# Altium schematic sheet bb_periferia.SchDoc
size A4; SheetNumber: 2; SheetTotal: 6
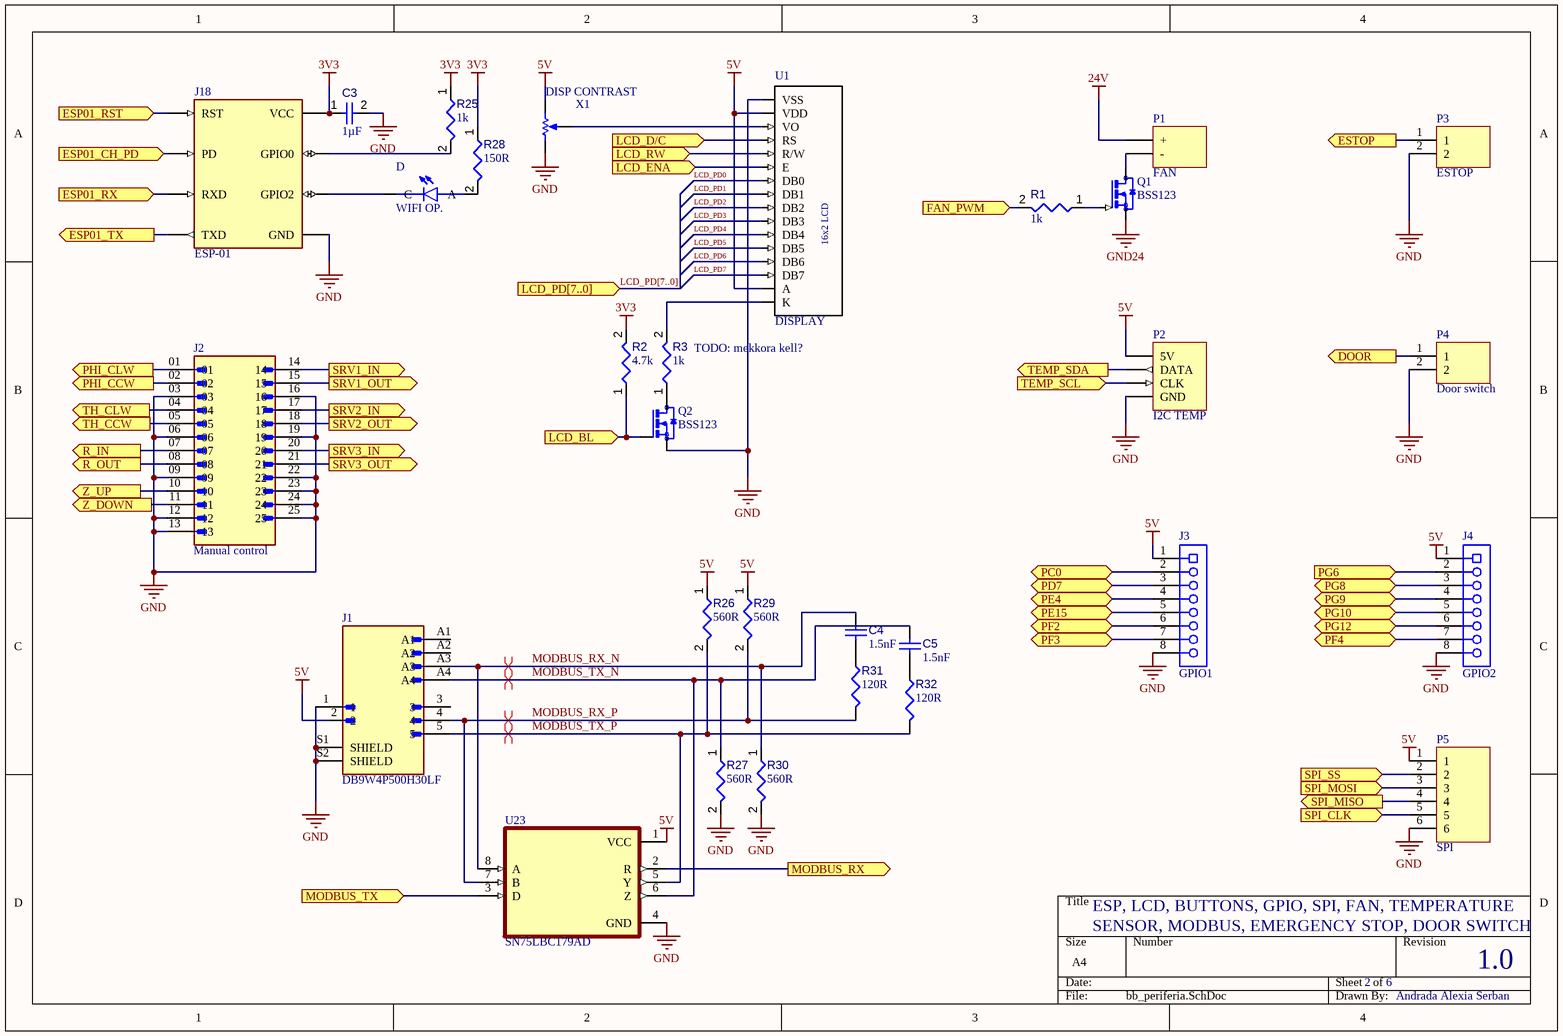
[diagram p0: bb_periferia.SchDoc]

## Parts
C3  value 1µF  [CAPC2013X145X50ML20T25]  (hidden comment: Capacitor 1 uF +/- 10% 25 V 0805)
C4  value 1.5nF  [CAPC2013X145X50ML20T25]  (hidden comment: Capacitor 1 uF +/- 10% 25 V 0805)
C5  value 1.5nF  [CAPC2013X145X50ML20T25]  (hidden comment: Capacitor 1 uF +/- 10% 25 V 0805)
D  WIFI OP.  [LEDC2012X70N]
J1  DB9W4P500H30LF  [AMPHENOL_DB9W4P500H30LF]
J2  Manual control  [AMPHENOL_DB25P564CTXLF]
J3  GPIO1  [SLIN-PPPC081LFBN-RC_V]
J4  GPIO2  [SLIN-PPPC081LFBN-RC_V]
J18  ESP-01  [ESP-01]
P1  FAN  [FP_CONN2_TAP_254MM]
P2  I2C TEMP  [FP_CONN4_TAP_254MM]
P3  ESTOP  [FP_CONN2_TAP_254MM]
P4  Door switch  [FP_CONN2_TAP_254MM]
P5  SPI  [FP_CONN6_TAP_254MM]
Q1  BSS123  [SOT23]
Q2  BSS123  [SOT23]
R1  value 1k  [RESC0402(1005)_L]  (hidden comment: Resistor 200R +/-5 % 0402 63 mW)
R2  value 4.7k  [RESC2013X70X40ML20T20]  (hidden comment: Resistor 4k7 +/-1% 0805 125 mW)
R3  value 1k  [RESC0805(2012)_L]  (hidden comment: 1KR5J)
R25  value 1k  [RESC0402(1005)_L]  (hidden comment: Resistor 200R +/-5 % 0402 63 mW)
R26  value 560R  [RESC0402(1005)_L]  (hidden comment: Resistor 200R +/-5 % 0402 63 mW)
R27  value 560R  [RESC0402(1005)_L]  (hidden comment: Resistor 200R +/-5 % 0402 63 mW)
R28  value 150R  [RESC0402(1005)_L]  (hidden comment: Resistor 200R +/-5 % 0402 63 mW)
R29  value 560R  [RESC0402(1005)_L]  (hidden comment: Resistor 200R +/-5 % 0402 63 mW)
R30  value 560R  [RESC0402(1005)_L]  (hidden comment: Resistor 200R +/-5 % 0402 63 mW)
R31  value 120R  [RESC0402(1005)_L]  (hidden comment: Resistor 200R +/-5 % 0402 63 mW)
R32  value 120R  [RESC0402(1005)_L]  (hidden comment: Resistor 200R +/-5 % 0402 63 mW)
U1  DISPLAY  [*LCD-16X2]
U23  SN75LBC179AD  [SOIC127P599X175-8N]
X1  DISP CONTRAST

## Ports
DOOR (out, see bb_Nucleo[4B]), ESP01_CH_PD (in, see bb_Nucleo[3B]), ESP01_RST (in, see bb_Nucleo[3B]), ESP01_RX (in, see bb_Nucleo[3B]), ESP01_TX (out, see bb_Nucleo[3B]), ESTOP (out, see bb_Nucleo[4B]), FAN_PWM (in, see bb_Nucleo[3C]), LCD_BL (in, see bb_Nucleo[3C]), LCD_D/C (in, see bb_Nucleo[4A]), LCD_ENA (in, see bb_Nucleo[4A]), LCD_PD[7..0] (in, see bb_Nucleo[4B]), LCD_RW (in, see bb_Nucleo[4A]), MODBUS_RX (out, see bb_Nucleo[3A]), MODBUS_TX (in, see bb_Nucleo[2B]), PC0 (bidir, see bb_Nucleo[2A]), PD7 (bidir, see bb_Nucleo[3A]), PE4 (bidir, see bb_Nucleo[3B]), PE15 (bidir, see bb_Nucleo[3C]), PF2 (bidir, see bb_Nucleo[4A]), PF3 (bidir, see bb_Nucleo[4A]), PF4 (bidir, see bb_Nucleo[4A]), PG6 (in, see bb_Nucleo[4B]), PG8 (bidir, see bb_Nucleo[4B]), PG9 (bidir, see bb_Nucleo[4B]), PG10 (bidir, see bb_Nucleo[4B]), PG12 (bidir, see bb_Nucleo[4C]), PHI_CCW (out, see bb_Nucleo[1B]), PHI_CLW (out, see bb_Nucleo[1B]), R_IN (out, see bb_Nucleo[1C]), R_OUT (out, see bb_Nucleo[1C]), SPI_CLK (in, see bb_Nucleo[2B]), SPI_MISO (out, see bb_Nucleo[2B]), SPI_MOSI (in, see bb_Nucleo[1B]), SPI_SS (in, see bb_Nucleo[1B]), SRV1_IN (out, see bb_Nucleo[2B]), SRV1_OUT (out, see bb_Nucleo[2B]), SRV2_IN (out, see bb_Nucleo[3B]), SRV2_OUT (out, see bb_Nucleo[3B]), SRV3_IN (out, see bb_Nucleo[3B]), SRV3_OUT (out, see bb_Nucleo[3B]), TEMP_SCL (in, see bb_Nucleo[4A]), TEMP_SDA (out, see bb_Nucleo[4A]), TH_CCW (out, see bb_Nucleo[2B]), TH_CLW (out, see bb_Nucleo[2B]), Z_DOWN (out, see bb_Nucleo[1C]), Z_UP (out, see bb_Nucleo[1B])

## Nets
3V3: C3.1 J18.7(VCC) R2.2 R25.1 R28.1
5V: J1.2 J3.1 J4.1 P2.1(5V) P5.1 R26.1 R29.1 U1.2(VDD) U1.15(A) U23.1(VCC) X1.2(BOT)
24V: P1.1(+)
GND: C3.2 J1.1 J1.S1(SHIELD) J1.S2(SHIELD) J2.03 J2.06 J2.09 J2.12 J2.13 J2.16 J2.19 J2.22 J2.23 J2.24 J2.25 J3.8 J4.8 J18.2(GND) P2.4(GND) P3.2 P4.2 P5.6 Q2.2(S) R27.2 R30.2 U1.1(VSS) U23.4(GND) X1.1(TOP)
GND24: Q1.2(S)
DOOR: P4.1 ; port DOOR
ESP01_CH_PD: J18.3(PD) ; port ESP01_CH_PD
ESP01_RST: J18.5(RST) ; port ESP01_RST
ESP01_RX: J18.8(RXD) ; port ESP01_RX
ESP01_TX: J18.1(TXD) ; port ESP01_TX
ESTOP: P3.1 ; port ESTOP
FAN_PWM: R1.2 ; port FAN_PWM
LCD_BL: Q2.1(G) R2.1 ; port LCD_BL
LCD_D/C: U1.4(RS) ; port LCD_D/C
LCD_ENA: U1.6(E) ; port LCD_ENA
LCD_PD0: U1.7(DB0)
LCD_PD1: U1.8(DB1)
LCD_PD2: U1.9(DB2)
LCD_PD3: U1.10(DB3)
LCD_PD4: U1.11(DB4)
LCD_PD5: U1.12(DB5)
LCD_PD6: U1.13(DB6)
LCD_PD7: U1.14(DB7)
LCD_RW: U1.5(R/W) ; port LCD_RW
MODBUS_RX: U23.2(R) ; port MODBUS_RX
MODBUS_RX_N: C4.2 J1.A3 R30.1 U23.8(A)
MODBUS_RX_P: J1.4 R29.2 R31.2 U23.7(B)
MODBUS_TX: U23.3(D) ; port MODBUS_TX
MODBUS_TX_N: C5.2 J1.A4 R27.1 U23.6(Z)
MODBUS_TX_P: J1.5 R26.2 R32.2 U23.5(Y)
PC0: J3.2 ; port PC0
PD7: J3.3 ; port PD7
PE4: J3.4 ; port PE4
PE15: J3.5 ; port PE15
PF2: J3.6 ; port PF2
PF3: J3.7 ; port PF3
PF4: J4.7 ; port PF4
PG6: J4.2 ; port PG6
PG8: J4.3 ; port PG8
PG9: J4.4 ; port PG9
PG10: J4.5 ; port PG10
PG12: J4.6 ; port PG12
PHI_CCW: J2.02 ; port PHI_CCW
PHI_CLW: J2.01 ; port PHI_CLW
R_IN: J2.07 ; port R_IN
R_OUT: J2.08 ; port R_OUT
SPI_CLK: P5.5 ; port SPI_CLK
SPI_MISO: P5.4 ; port SPI_MISO
SPI_MOSI: P5.3 ; port SPI_MOSI
SPI_SS: P5.2 ; port SPI_SS
SRV1_IN: J2.14 ; port SRV1_IN
SRV1_OUT: J2.15 ; port SRV1_OUT
SRV2_IN: J2.17 ; port SRV2_IN
SRV2_OUT: J2.18 ; port SRV2_OUT
SRV3_IN: J2.20 ; port SRV3_IN
SRV3_OUT: J2.21 ; port SRV3_OUT
TEMP_SCL: P2.3(CLK) ; port TEMP_SCL
TEMP_SDA: P2.2(DATA) ; port TEMP_SDA
TH_CCW: J2.05 ; port TH_CCW
TH_CLW: J2.04 ; port TH_CLW
Z_DOWN: J2.11 ; port Z_DOWN
Z_UP: J2.10 ; port Z_UP
NetC4_1: C4.1 R31.1
NetC5_1: C5.1 R32.1
NetD_A: D.A R28.2
NetD_C: D.C J18.4(GPIO2)
NetJ18_6: J18.6(GPIO0) R25.2
NetP1_2: P1.2(-) Q1.3(D)
NetQ1_1: Q1.1(G) R1.1
NetQ2_3: Q2.3(D) R3.1
NetR3_2: R3.2 U1.16(K)
NetU1_3: U1.3(VO) X1.3(TAP)

Not connected (* = marked no-connect by the designer): J1 3 A1 A2

## Buses and harness runs
bus LCD_PD[7..0] = port LCD_PD[7..0]

## Layout directives
differential pair: MODBUS_RX_N, MODBUS_RX_P, MODBUS_TX_N, MODBUS_TX_P

## Notes on the sheet
- TODO: mekkora kell?
- ESP, LCD, BUTTONS, GPIO, SPI, FAN, TEMPERATURE
- SENSOR, MODBUS, EMERGENCY STOP, DOOR SWITCH
- 2
- 6
- 1.0
- Andrada Alexia Serban
- (in symbol LCD-16X2) 16x2 LCD

## Library data of the parts
C3-C5 = CMP-001-00010-6: Chip Capacitor, 1 uF, +/-10%, 25 V, 0805 (2012 Metric); Capacitor Type: Ceramic; Voltage Rating: 25V; RoHS Compliant: True; Pins: 2; Mounting Technology: SM; Max Operating Temperature: 125°C; Min Operating Temperature: -55°C; Tolerance: 10%; Case/Package: 0805
D = CMP-023-000000-1: Blue 473nm LED Indication - Discrete 3.2V 0805 _2012 Metric_; MF: Dialight; MP: 598-8191-107F; Price: None; Availability: Unavailable; Package: 0805 Dialight; Component Type: Standard; Design Item ID: 598-8191-107F; Source: SnapEDAsch.SchLib; SnapEDA_Link: https://www.snapeda.com/parts/598-8191-107F/Dialight/view-part/432480/?ref=snap; Value: *; Pin Count: 2
J1 = CMP-034-000000-1: D-Sub Power Board Mount Connectors, Input Output Connectors, Mixed Signal and Power 9W4 Pin Right Angle Solder 30A, Europe Standard, 200 Cycles, Front: Without Accessory, Back: Harpoons for 2.4mm PCB Thickness.; MF: Amphenol FCI; Check_prices: https://www.snapeda.com/parts/DB9W4P500H30LF/Amphenol/view-part/?ref=eda; Availability: Not in stock; Pin Count: 11; SnapEDA_Link: https://www.snapeda.com/parts/DB9W4P500H30LF/Amphenol/view-part/?ref=snap; MP: DB9W4P500H30LF; Component Type: Standard; Design Item ID: DB9W4P500H30LF; Source: DB9W4P500H30LF.SchLib; Package: None; Price: None; Value: *
J2 = CMP-028-000000-1: DB25P564CTXLF-DSUB R/A STB 25PIN LF; MF: Amphenol ICC (FCI); Package: None; Design Item ID: DB25P564CTXLF; Value: *; Check_prices: https://www.snapeda.com/parts/DB25P564CTXLF/Amphenol+FCI/view-part/?ref=eda; Source: DB25P564CTXLF.SchLib; Pin Count: 25; Digi-Key_Part_Number: DB25P564CTXLF-ND; MP: DB25P564CTXLF; Component Type: Standard; SnapEDA_Link: https://www.snapeda.com/parts/DB25P564CTXLF/Amphenol+FCI/view-part/?ref=snap; Purchase-URL: https://pricing.snapeda.com/search/part/DB25P564CTXLF/?ref=eda
J3 J4 = CMP-002-00028-2: Female Header, Pitch 2.54 mm, 1 x 8 Position, Height 8.5 mm, Tail Length 3.2 mm, -40 to 105 degC, RoHS, Bulk; Manufacturer: Sullins; Package Reference: PPPC081LFBN-RC; Connector Type: Header; Datasheet Version: Jan-15; Package Description: Female Header, Pitch 2.54 mm, 1 x 8 Position, Height 8.5 mm, Tail Length 3.2 mm; RoHS Compliant: Unknown; Max Operating Temperature: 105°C; Case/Package: PPPC081LFBN-RC; Min Operating Temperature: -40°C; Datasheet URL: http://sullinscorp.com/catalogs/101_PAGE114-115_.100_FEMALE_HDR.pdf; Gender: Female; Mounting Technology: TH
J18 = CMP-017-000000-1: ESP-01M ESP8266 DIP Adapter series Transceiver; 802.11 b/g/n (Wi-Fi, WiFi, WLAN) Evaluation Board; MF: AI-Thinker; Availability: Not in stock; Package: Non-Standard AI-Thinker; MP: ESP-01; Value: *; SnapEDA_Link: https://www.snapeda.com/parts/ESP-01/AI-Thinker/view-part/?ref=snap; Price: None; Check_prices: https://www.snapeda.com/parts/ESP-01/AI-Thinker/view-part/?ref=eda; Design Item ID: ESP-01; Component Type: Standard; Source: ESP-01.SchLib; Pin Count: 8
P1 P3 P4 = Connector_2pin: 2pin connector
P2 = Connector_4pin: 4pin Connector
P5 = Connector_6pin: 6pin connector
Q1 Q2 = CMP-021-000000-1: N-Channel 100V 170mA _Ta_ 360mW _Ta_ Surface Mount SOT-23-3; MF: ON Semiconductor; Design Item ID: BSS123; Source: SnapEDAsch.SchLib; Package: SOT-23 ON Semiconductor; Value: *; SnapEDA_Link: https://www.snapeda.com/parts/BSS123/ON%20Semiconductor/view-part/2489351/?ref=snap; Availability: Unavailable; Price: None; Component Type: Standard; MP: BSS123; Pin Count: 3
R1 R25-R32 = CMP-009-00161-3: Chip Resistor, 200 Ohms, +/-5 %, 63 mW, -55 to 155 degC, 0402; Power: 63mW; Tolerance: 5%; Min Operating Temperature: -55°C; Case/Package: 0402; Max Operating Temperature: 155°C; Pins: 2
R2 = CMP-009-00032-5: Chip Resistor, 4.7 KOhm, +/- 1%, 0.125 W, -55 to 155 degC, 0805 (2012 Metric); Power: 125mW; Voltage Rating: 150V; Max Operating Temperature: 155°C; Min Operating Temperature: -55°C; Case/Package: 0805; RoHS Compliant: True; Pins: 2; Tolerance: 1%; Mounting Technology: SM
R3 = CMP-009-00076-2: 1K 0.125W 5% 0805 (2012 Metric)  SMD; Power: 125mW; Pins: 2; Mounting Technology: SMT; Tolerance: 5%; Case/Package: 0805
U1 = LCD-16X2: Display Development Tools 16x2 Black on Green Char LCD w Backlight; MF: Gravitech; Availability: In Stock; Package: None; MP: LCD-16X2; SnapEDA_Link: https://www.snapeda.com/parts/LCD-16X2/Gravitech/view-part/?ref=snap; Price: None; Purchase-URL: https://pricing.snapeda.com/search/part/LCD-16X2/?ref=eda; Check_prices: https://www.snapeda.com/parts/LCD-16X2/Gravitech/view-part/?ref=eda; Value: *
U23 = CMP-032-000000-1: Design Item ID: SN75LBC179AD; Availability: Unavailable; Package: None; Price: None; MP: SN75LBC179AD; Pin Count: 8; Component Type: Standard; Value: *; Source: SN75LBC179AD.SchLib
X1 = Potentiometer: value: 1k; position: 0.5; SimulationGenericComponent: True